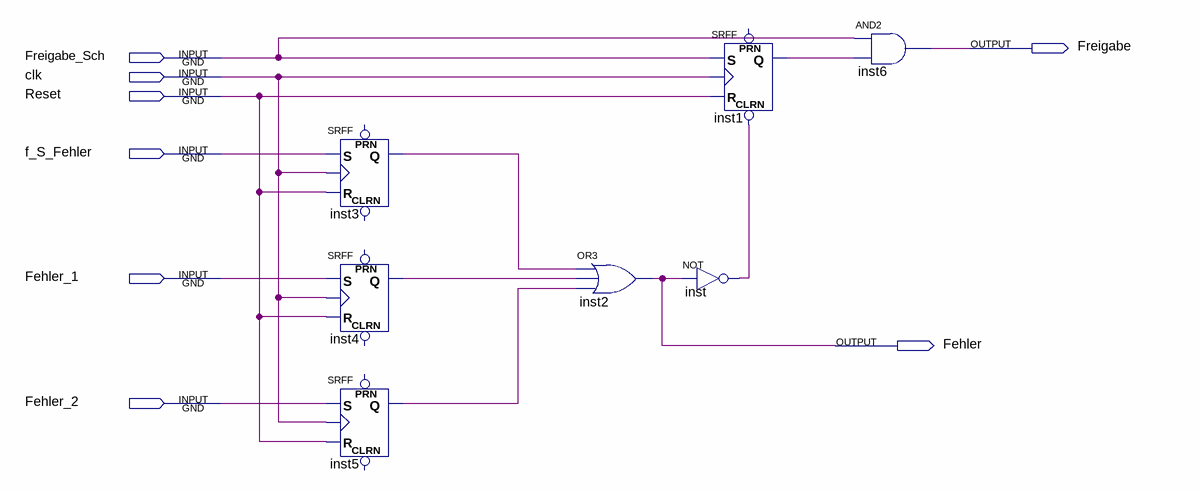
[diagram p0: schematic sheet]
// Quartus schematic Fehlerauswertung.bdf as structural Verilog: 7 symbols, 8 pins
module Fehlerauswertung (
  input  Freigabe_Sch,
  input  clk,
  input  Reset,
  input  f_S_Fehler,
  input  Fehler_1,
  input  Fehler_2,
  output Freigabe,
  output Fehler
);

  wire inst1_q, inst3_q, inst4_q, inst5_q, inst_out;

  SRFF inst3 (.S(f_S_Fehler), .R(Reset), .CLK(clk), .Q(inst3_q));  // open: PRN, CLRN
  SRFF inst4 (.S(Fehler_1), .R(Reset), .CLK(clk), .Q(inst4_q));  // open: PRN, CLRN
  SRFF inst5 (.S(Fehler_2), .R(Reset), .CLK(clk), .Q(inst5_q));  // open: PRN, CLRN
  or inst2 (Fehler, inst3_q, inst4_q, inst5_q);
  not inst (inst_out, Fehler);
  SRFF inst1 (.CLRN(inst_out), .S(Freigabe_Sch), .R(Reset), .CLK(clk), .Q(inst1_q));  // open: PRN
  and inst6 (Freigabe, Freigabe_Sch, inst1_q);
endmodule
